# EAGLE schematic STM32F407VGT6 (EAGLE 9.7.0)
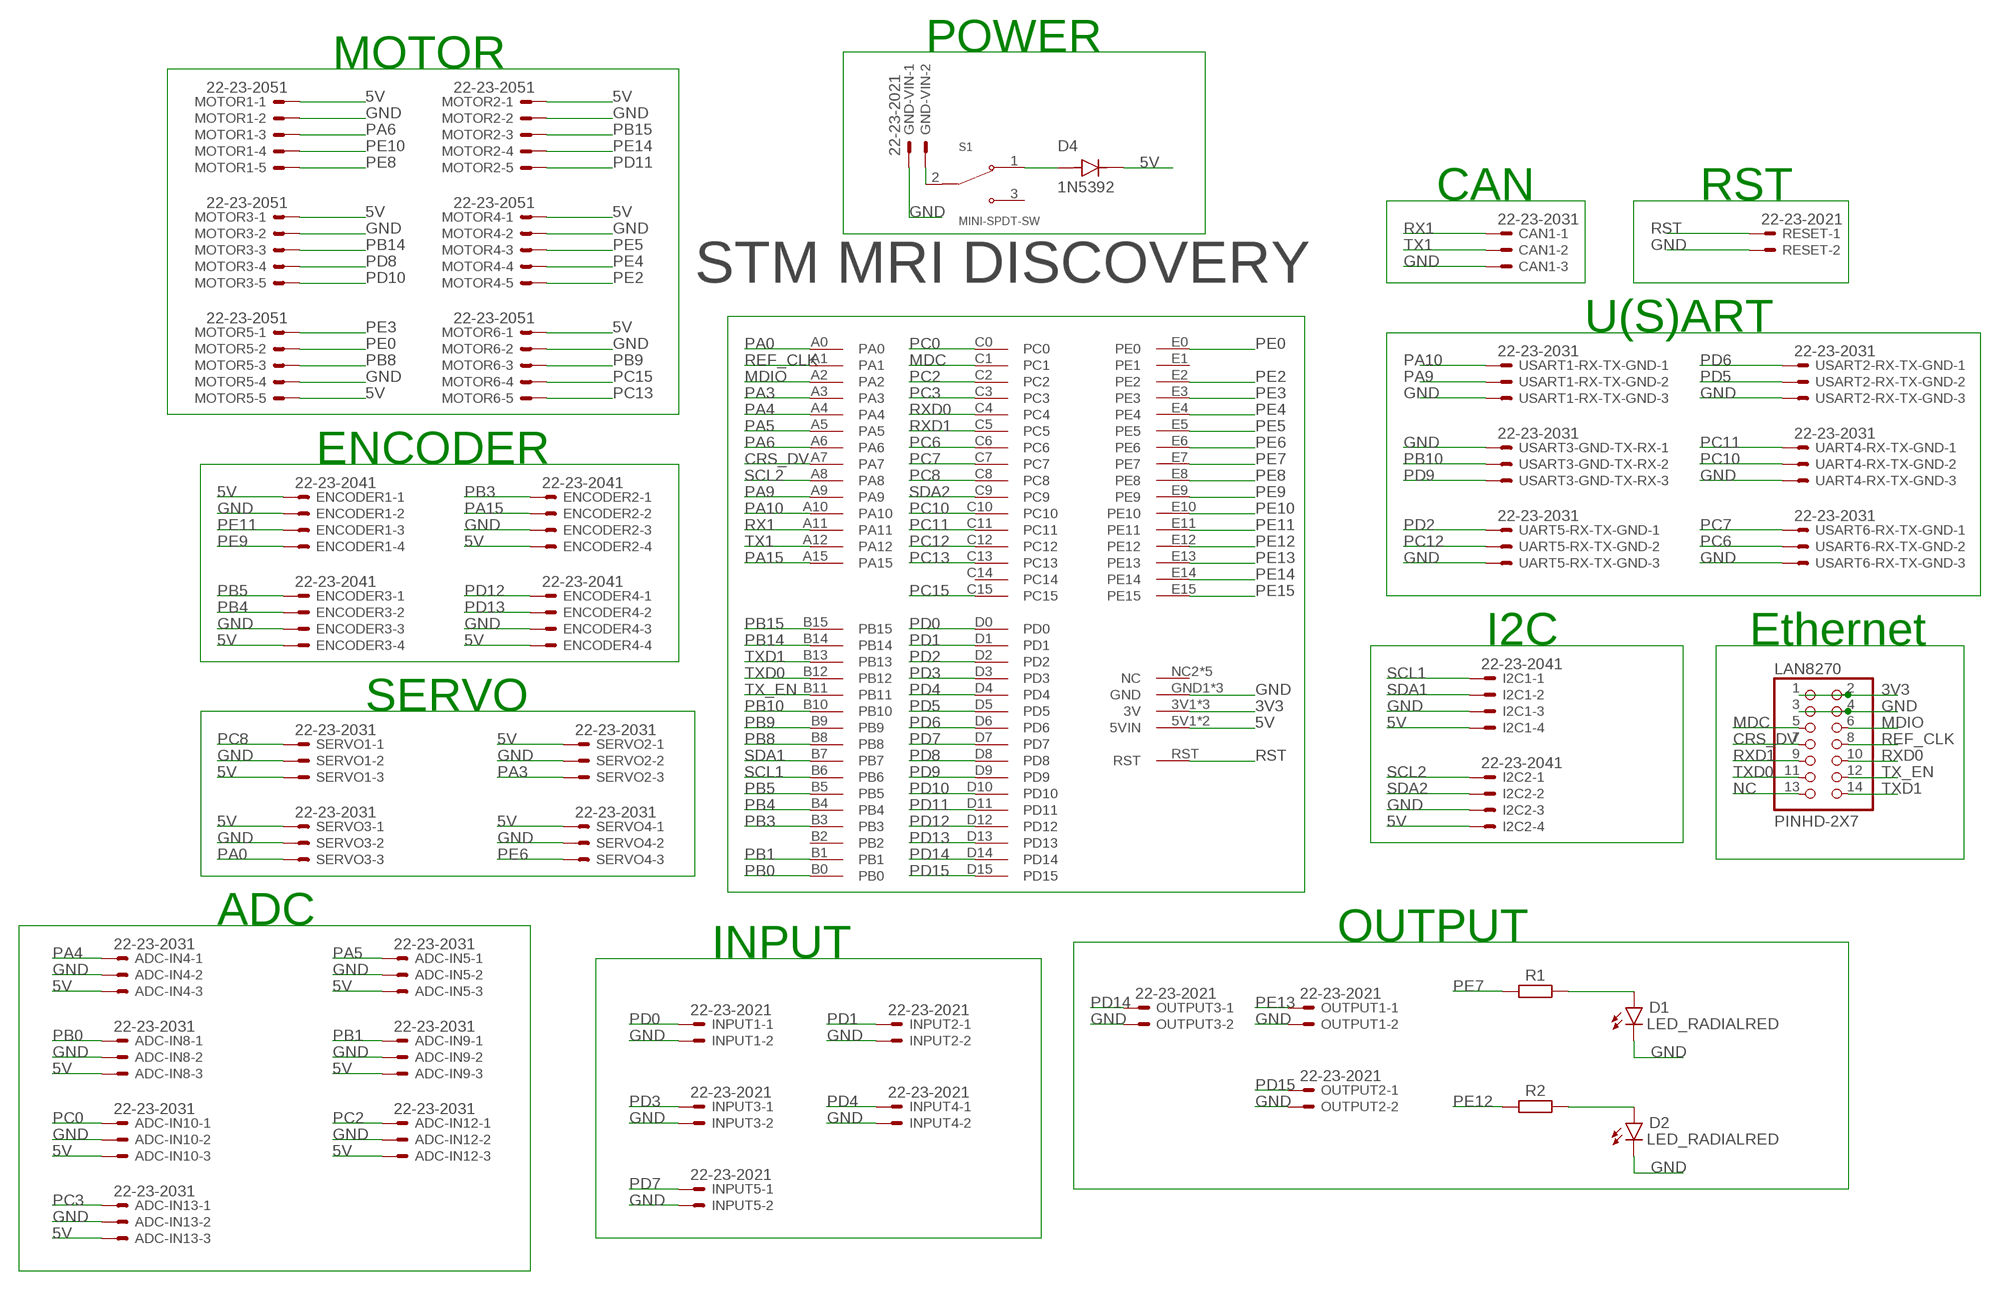
[diagram p0: schematic, sheet 1]

## Parts
ADC-IN4  22-23-2031  [22-23-2031]
ADC-IN5  22-23-2031  [22-23-2031]
ADC-IN8  22-23-2031  [22-23-2031]
ADC-IN9  22-23-2031  [22-23-2031]
ADC-IN10  22-23-2031  [22-23-2031]
ADC-IN12  22-23-2031  [22-23-2031]
ADC-IN13  22-23-2031  [22-23-2031]
CAN1  22-23-2031  [22-23-2031]
D1  LED_RADIALRED  [LEDRD254W60D565H860B_R]
D2  LED_RADIALRED  [LEDRD254W60D565H860B_R]
D4  1N5392  [DIOAD1300W80L670D310]
ENCODER1  22-23-2041  [22-23-2041]
ENCODER2  22-23-2041  [22-23-2041]
ENCODER3  22-23-2041  [22-23-2041]
ENCODER4  22-23-2041  [22-23-2041]
GND-VIN  22-23-2021  [22-23-2021]
I2C1  22-23-2041  [22-23-2041]
I2C2  22-23-2041  [22-23-2041]
INPUT1  22-23-2021  [22-23-2021]
INPUT2  22-23-2021  [22-23-2021]
INPUT3  22-23-2021  [22-23-2021]
INPUT4  22-23-2021  [22-23-2021]
INPUT5  22-23-2021  [22-23-2021]
LAN8270  PINHD-2X7  [2X07]
MOTOR1  22-23-2051  [22-23-2051]
MOTOR2  22-23-2051  [22-23-2051]
MOTOR3  22-23-2051  [22-23-2051]
MOTOR4  22-23-2051  [22-23-2051]
MOTOR5  22-23-2051  [22-23-2051]
MOTOR6  22-23-2051  [22-23-2051]
OUTPUT1  22-23-2021  [22-23-2021]
OUTPUT2  22-23-2021  [22-23-2021]
OUTPUT3  22-23-2021  [22-23-2021]
R1  R_AXIAL-11.7MM-PITCH  [RESAD1176W63L850D250B]
R2  R_AXIAL-11.7MM-PITCH  [RESAD1176W63L850D250B]
RESET  22-23-2021  [22-23-2021]
S1  MINI-SPDT-SW  [SW_MINI-SPDT-SW]
SERVO1  22-23-2031  [22-23-2031]
SERVO2  22-23-2031  [22-23-2031]
SERVO3  22-23-2031  [22-23-2031]
SERVO4  22-23-2031  [22-23-2031]
U$1  STM32F4HEADER  [STM32F4HEAD]
UART4-RX-TX-GND  22-23-2031  [22-23-2031]
UART5-RX-TX-GND  22-23-2031  [22-23-2031]
USART1-RX-TX-GND  22-23-2031  [22-23-2031]
USART2-RX-TX-GND  22-23-2031  [22-23-2031]
USART3-GND-TX-RX  22-23-2031  [22-23-2031]
USART6-RX-TX-GND  22-23-2031  [22-23-2031]

## Nets
3V3: LAN8270.1 LAN8270.2 U$1.3V1(3V) U$1.3V2(3V) U$1.3V3(3V)
5V: ADC-IN4.3 ADC-IN5.3 ADC-IN8.3 ADC-IN9.3 ADC-IN10.3 ADC-IN12.3 ADC-IN13.3 D4.C(K) ENCODER1.1 ENCODER2.4 ENCODER3.4 ENCODER4.4 I2C1.4 I2C2.4 MOTOR1.1 MOTOR2.1 MOTOR3.1 MOTOR4.1 MOTOR5.5 MOTOR6.1 SERVO1.3 SERVO2.1 SERVO3.1 SERVO4.1 U$1.5V1(5VIN) U$1.5V2(5VIN)
CRS_DV: LAN8270.7 U$1.A7
GND: ADC-IN4.2 ADC-IN5.2 ADC-IN8.2 ADC-IN9.2 ADC-IN10.2 ADC-IN12.2 ADC-IN13.2 CAN1.3 D1.C D2.C ENCODER1.2 ENCODER2.3 ENCODER3.3 ENCODER4.3 GND-VIN.1 I2C1.3 I2C2.3 INPUT1.2 INPUT2.2 INPUT3.2 INPUT4.2 INPUT5.2 LAN8270.3 LAN8270.4 MOTOR1.2 MOTOR2.2 MOTOR3.2 MOTOR4.2 MOTOR5.4 MOTOR6.2 OUTPUT1.2 OUTPUT2.2 OUTPUT3.2 RESET.2 SERVO1.2 SERVO2.2 SERVO3.2 SERVO4.2 U$1.GND1(GND) U$1.GND2(GND) U$1.GND3(GND) UART4-RX-TX-GND.3 UART5-RX-TX-GND.3 USART1-RX-TX-GND.3 USART2-RX-TX-GND.3 USART3-GND-TX-RX.1 USART6-RX-TX-GND.3
MDC: LAN8270.5 U$1.C1
MDIO: LAN8270.6 U$1.A2
N$4: D4.A S1.1
N$5: GND-VIN.2 S1.2
N$17: D1.A R1.2
N$18: D2.A R2.2
NC: LAN8270.13
PA0: SERVO3.3 U$1.A0
PA3: SERVO2.3 U$1.A3
PA4: ADC-IN4.1 U$1.A4
PA5: ADC-IN5.1 U$1.A5
PA6: MOTOR1.3 U$1.A6
PA9: U$1.A9 USART1-RX-TX-GND.2
PA10: U$1.A10 USART1-RX-TX-GND.1
PA15: ENCODER2.2 U$1.A15
PB0: ADC-IN8.1 U$1.B0
PB1: ADC-IN9.1 U$1.B1
PB3: ENCODER2.1 U$1.B3
PB4: ENCODER3.2 U$1.B4
PB5: ENCODER3.1 U$1.B5
PB8: MOTOR5.3 U$1.B8
PB9: MOTOR6.3 U$1.B9
PB10: U$1.B10 USART3-GND-TX-RX.2
PB14: MOTOR3.3 U$1.B14
PB15: MOTOR2.3 U$1.B15
PC0: ADC-IN10.1 U$1.C0
PC2: ADC-IN12.1 U$1.C2
PC3: ADC-IN13.1 U$1.C3
PC6: U$1.C6 USART6-RX-TX-GND.2
PC7: U$1.C7 USART6-RX-TX-GND.1
PC8: SERVO1.1 U$1.C8
PC10: U$1.C10 UART4-RX-TX-GND.2
PC11: U$1.C11 UART4-RX-TX-GND.1
PC12: U$1.C12 UART5-RX-TX-GND.2
PC13: MOTOR6.5 U$1.C13
PC15: MOTOR6.4 U$1.C15
PD0: INPUT1.1 U$1.D0
PD1: INPUT2.1 U$1.D1
PD2: U$1.D2 UART5-RX-TX-GND.1
PD3: INPUT3.1 U$1.D3
PD4: INPUT4.1 U$1.D4
PD5: U$1.D5 USART2-RX-TX-GND.2
PD6: U$1.D6 USART2-RX-TX-GND.1
PD7: INPUT5.1 U$1.D7
PD8: MOTOR3.4 U$1.D8
PD9: U$1.D9 USART3-GND-TX-RX.3
PD10: MOTOR3.5 U$1.D10
PD11: MOTOR2.5 U$1.D11
PD12: ENCODER4.1 U$1.D12
PD13: ENCODER4.2 U$1.D13
PD14: OUTPUT3.1 U$1.D14
PD15: OUTPUT2.1 U$1.D15
PE0: MOTOR5.2 U$1.E0
PE2: MOTOR4.5 U$1.E2
PE3: MOTOR5.1 U$1.E3
PE4: MOTOR4.4 U$1.E4
PE5: MOTOR4.3 U$1.E5
PE6: SERVO4.3 U$1.E6
PE7: R1.1 U$1.E7
PE8: MOTOR1.5 U$1.E8
PE9: ENCODER1.4 U$1.E9
PE10: MOTOR1.4 U$1.E10
PE11: ENCODER1.3 U$1.E11
PE12: R2.1 U$1.E12
PE13: OUTPUT1.1 U$1.E13
PE14: MOTOR2.4 U$1.E14
PE15: U$1.E15
REF_CLK: LAN8270.8 U$1.A1
RST: RESET.1 U$1.RST
RX1: CAN1.1 U$1.A11
RXD0: LAN8270.10 U$1.C4
RXD1: LAN8270.9 U$1.C5
SCL1: I2C1.1 U$1.B6
SCL2: I2C2.1 U$1.A8
SDA1: I2C1.2 U$1.B7
SDA2: I2C2.2 U$1.C9
TX1: CAN1.2 U$1.A12
TX_EN: LAN8270.12 U$1.B11
TXD0: LAN8270.11 U$1.B12
TXD1: LAN8270.14 U$1.B13
Unconnected: S1.3 U$1.B2 U$1.C14 U$1.E1 U$1.NC2(NC) U$1.NC3(NC) U$1.NC4(NC) U$1.NC5(NC) U$1.NC6(NC)

## Notes on the sheet
- POWER
- MOTOR
- CAN | RST
- U(S)ART
- ENCODER
- I2C | Ethernet
- SERVO
- ADC
- OUTPUT
- INPUT

## Library data of the parts
ADC-IN4 ADC-IN5 ADC-IN8-ADC-IN10 ADC-IN12 ADC-IN13 CAN1 SERVO1-SERVO4 UART4-RX-TX-GND UART5-RX-TX-GND USART1-RX-TX-GND USART2-RX-TX-GND USART3-GND-TX-RX USART6-RX-TX-GND = con-molex:22-23-2031: .100" (2.54mm) Center Header - 3 Pin; MF: MOLEX; MPN: 22-23-2031; OC_FARNELL: 1462950; OC_NEWARK: 30C0862
D1 D2 = Opto-Electronic:LED_RADIAL: LED - Generic
D4 = 1N5392:1N5392: Check availability <https://pricing.snapeda.com/parts/1N5392/onsemi/view-part?ref=eda>; AVAILABILITY: In Stock; CHECK_PRICES: https://www.snapeda.com/parts/1N5392/Onsemi/view-part/?ref=eda; DESCRIPTION: Diode 100 V 1.5A Through Hole DO-15; MF: onsemi; MP: 1N5392; PACKAGE: None; PRICE: None; SNAPEDA_LINK: https://www.snapeda.com/parts/1N5392/Onsemi/view-part/?ref=snap
ENCODER1-ENCODER4 I2C1 I2C2 = con-molex:22-23-2041: .100" (2.54mm) Center Header - 4 Pin; MF: MOLEX; MPN: 22-23-2041; OC_FARNELL: 1462920; OC_NEWARK: 38C0355
GND-VIN INPUT1-INPUT5 OUTPUT1-OUTPUT3 RESET = con-molex:22-23-2021: .100" (2.54mm) Center Header - 2 Pin; MF: MOLEX; MPN: 22-23-2021; OC_FARNELL: 1462926; OC_NEWARK: 25C3832
LAN8270 = Connector:PINHD-2X7: PIN HEADER; CATEGORY: Headers; DESCRIPTION: Header, Straight, 2x7 Position; MANUFACTURER: Generic; MPN: Generic; OPERATING_TEMPERATURE: Generic; PART_STATUS: Active; PITCH: 0.100" (2.54mm); ROHS_COMPLIANCE: Generic; SERIES: Generic; SUB-CATEGORY: Headers, Male Pins; TYPE: Board to Board or Cable, Unshrouded, Through Hole, Straight
MOTOR1-MOTOR6 = con-molex:22-23-2051: .100" (2.54mm) Center Header - 5 Pin; MF: MOLEX; MPN: 22-23-2051; OC_FARNELL: 1462952; OC_NEWARK: 38C9178
R1 R2 = Resistor:R: Resistor Fixed - Generic; CATEGORY: Resistor; SUB-CATEGORY: Fixed
S1 = MINI-SPDT-SW:MINI-SPDT-SW: Simple breadboard friendly SPDT slide switch. Rated at 30V/200mA with operating force of 250 +/-100gf. Check availability <https://pricing.snapeda.com/parts/MINI-SPDT-SW/Gravitech/view-part?ref=eda>; AVAILABILITY: Not in stock; CHECK_PRICES: https://www.snapeda.com/parts/MINI-SPDT-SW/Gravitech/view-part/?ref=eda; DESCRIPTION: Slide Switches MINI SPDT SWITCH; MF: Gravitech; MP: MINI-SPDT-SW; PACKAGE: None; PRICE: None; SNAPEDA_LINK: https://www.snapeda.com/parts/MINI-SPDT-SW/Gravitech/view-part/?ref=snap
U$1 = stm32header:STM32F4HEADER